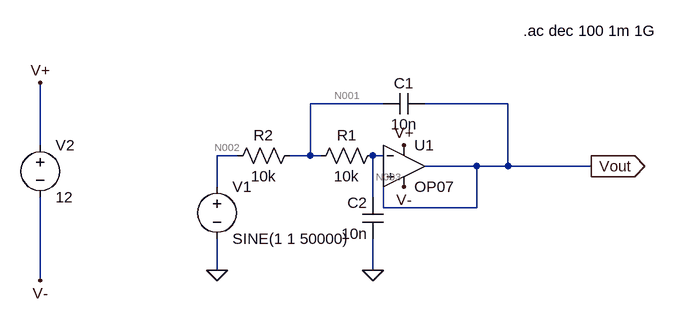
[diagram p0: schematic Sallen key filter.asc]
Sallen key filter.asc, the LTspice schematic file:
Version 4
SHEET 1 980 680
WIRE 416 256 304 256
WIRE 608 256 480 256
WIRE -112 320 -112 224
WIRE 192 336 160 336
WIRE 304 336 304 256
WIRE 304 336 272 336
WIRE 320 336 304 336
WIRE 416 336 400 336
WIRE 560 352 480 352
WIRE 608 352 608 256
WIRE 608 352 560 352
WIRE 736 352 608 352
WIRE 160 384 160 336
WIRE 400 400 400 336
WIRE 416 416 416 368
WIRE 560 416 560 352
WIRE 560 416 416 416
WIRE 160 512 160 464
WIRE 400 512 400 464
WIRE -112 528 -112 400
FLAG 400 512 0
FLAG 160 512 0
FLAG -112 528 V-
FLAG -112 224 V+
FLAG 448 320 V+
FLAG 448 384 V-
FLAG 736 352 Vout
IOPIN 736 352 Out
SYMBOL OpAmps/OP07 448 288 R0
SYMATTR InstName U1
SYMBOL res 416 320 R90
WINDOW 0 0 56 VBottom 2
WINDOW 3 32 56 VTop 2
SYMATTR InstName R1
SYMATTR Value 10k
SYMBOL res 288 320 R90
WINDOW 0 0 56 VBottom 2
WINDOW 3 32 56 VTop 2
SYMATTR InstName R2
SYMATTR Value 10k
SYMBOL cap 480 240 R90
WINDOW 0 0 32 VBottom 2
WINDOW 3 32 32 VTop 2
SYMATTR InstName C1
SYMATTR Value 10n
SYMBOL cap 416 464 R180
WINDOW 0 24 56 Left 2
WINDOW 3 24 8 Left 2
SYMATTR InstName C2
SYMATTR Value 10n
SYMBOL voltage 160 368 R0
SYMATTR InstName V1
SYMATTR Value SINE(1 1 50000)
SYMATTR Value2 AC 1
SYMBOL voltage -112 304 R0
SYMATTR InstName V2
SYMATTR Value 12
TEXT 632 144 Left 2 !.ac dec 100 1m 1G

The netlist it stands for:
* Sallen key filter.asc
XU1 Vout N003 V+ V- Vout LT1001  ; OP07, pins In+ In- V+ V- OUT
R1 N003 N001 10k
R2 N001 N002 10k
C1 Vout N001 10n
C2 0 N003 10n
V1 N002 0 SINE(1 1 50000) AC 1
V2 V+ V- 12
.ac dec 100 1m 1G
.lib LTC.lib
.backanno
.end

* Results of the author's LTspice run, read from the files saved beside the schematic
* Operating Point, zero values left out:
*   V(n003) = 860 mV
*   V(vout) = -266.7 mV
*   V(v+) = 10.8 V
*   V(v-) = -1.197 V
*   V(n001) = 930 mV
*   V(n002) = 1 V
*   I(R2) = -7 µA
*   I(R1) = -7 µA
*   I(V2) = -2.25 mA
*   I(V1) = -7 µA
*   Ix(u1:1) = -7 µA
*   Ix(u1:2) = 7 µA
*   Ix(u1:3) = 2.25 mA
*   Ix(u1:4) = -2.25 mA
*   Ix(u1:5) = 7 µA
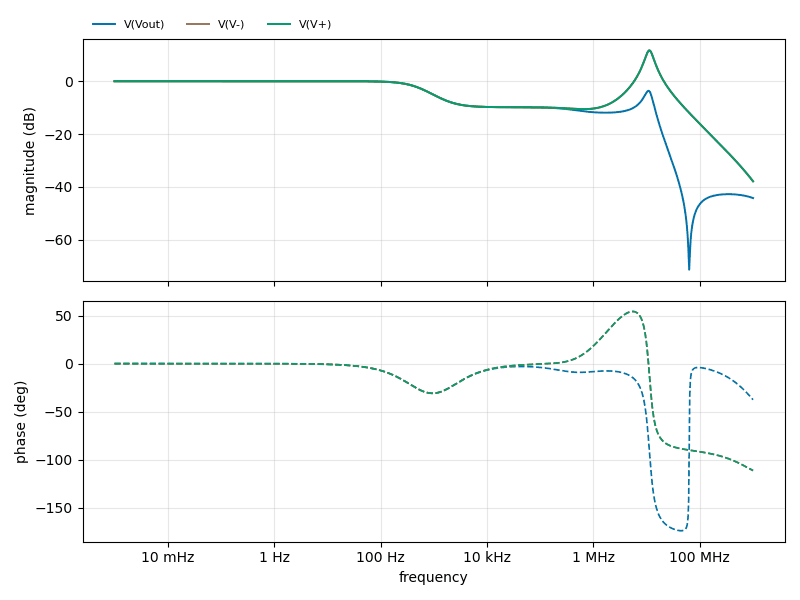
[diagram p1: AC Analysis of Sallen key filter.asc, plotted from the saved traces]
* AC Analysis, 1 run:
*   V(Vout): -0.00 dB at 1 mHz, -44.27 dB at 1 GHz, peak -0.00 dB at 1.047 mHz, 3 dB below the peak at 604 Hz
*   V(V-): -0.00 dB at 1 mHz, -37.90 dB at 1 GHz, peak 11.68 dB at 11.22 MHz, 3 dB below the peak at 9.368 MHz and 13.47 MHz
*   V(V+): -0.00 dB at 1 mHz, -37.90 dB at 1 GHz, peak 11.68 dB at 11.22 MHz, 3 dB below the peak at 9.368 MHz and 13.47 MHz